# Altium project Bien_Quang_Cao_ver2.PrjPcb
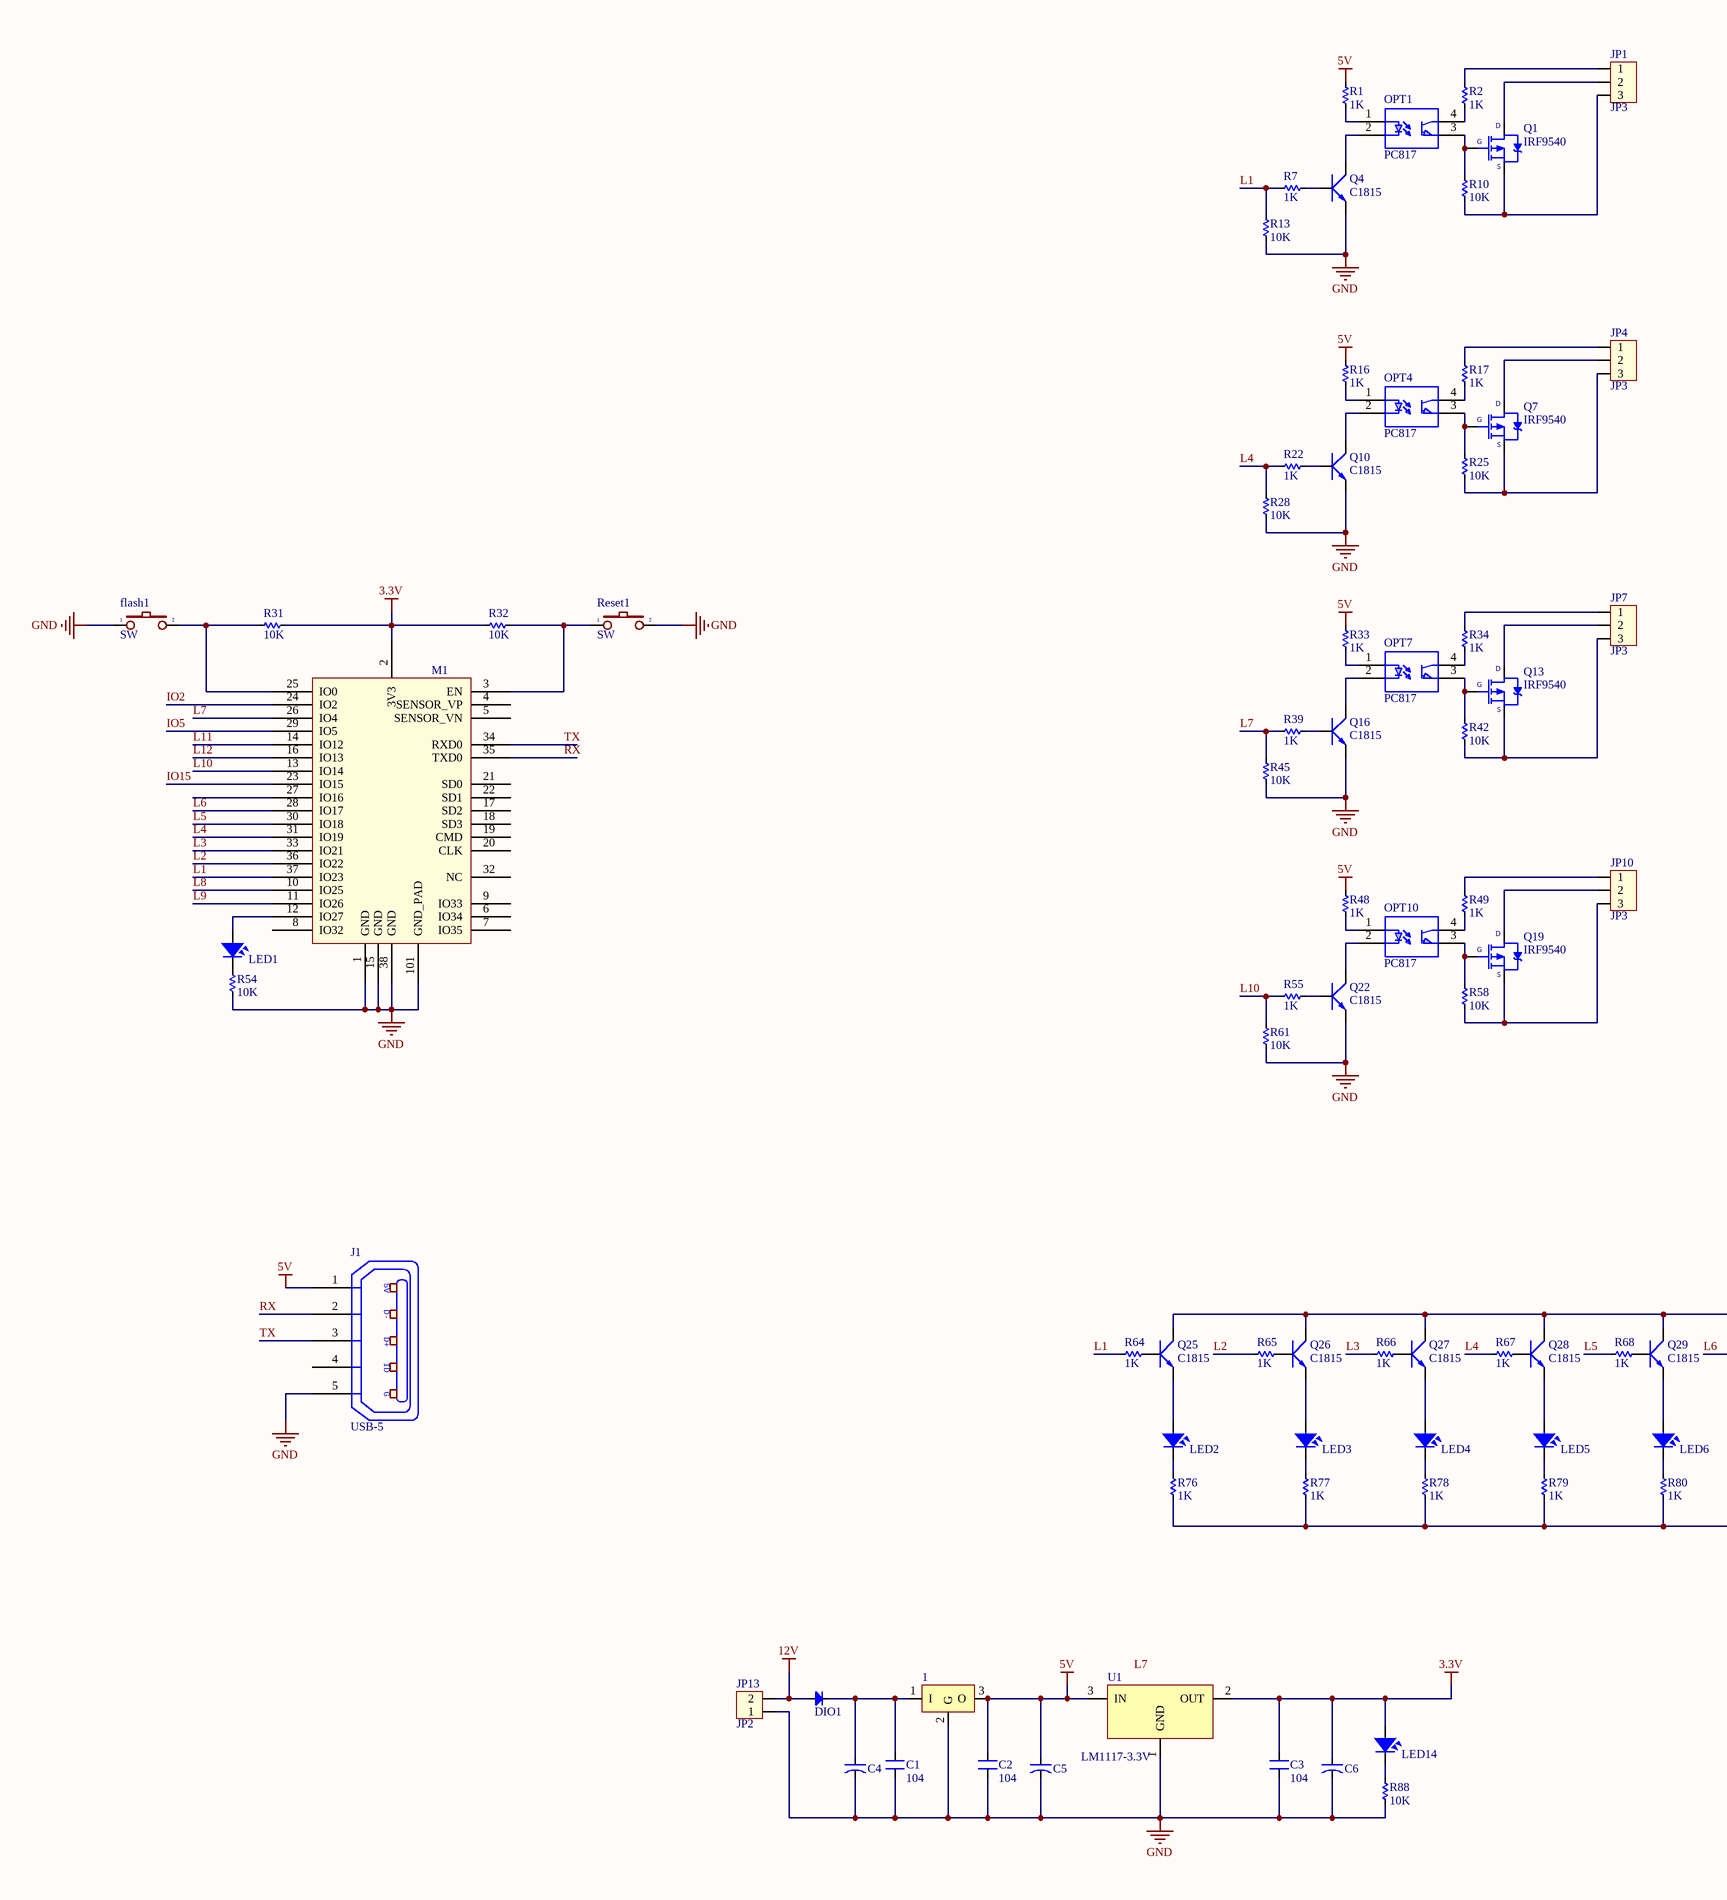
[diagram p0: Bien_Quang_Cao_ver2_schematic.SchDoc, left]
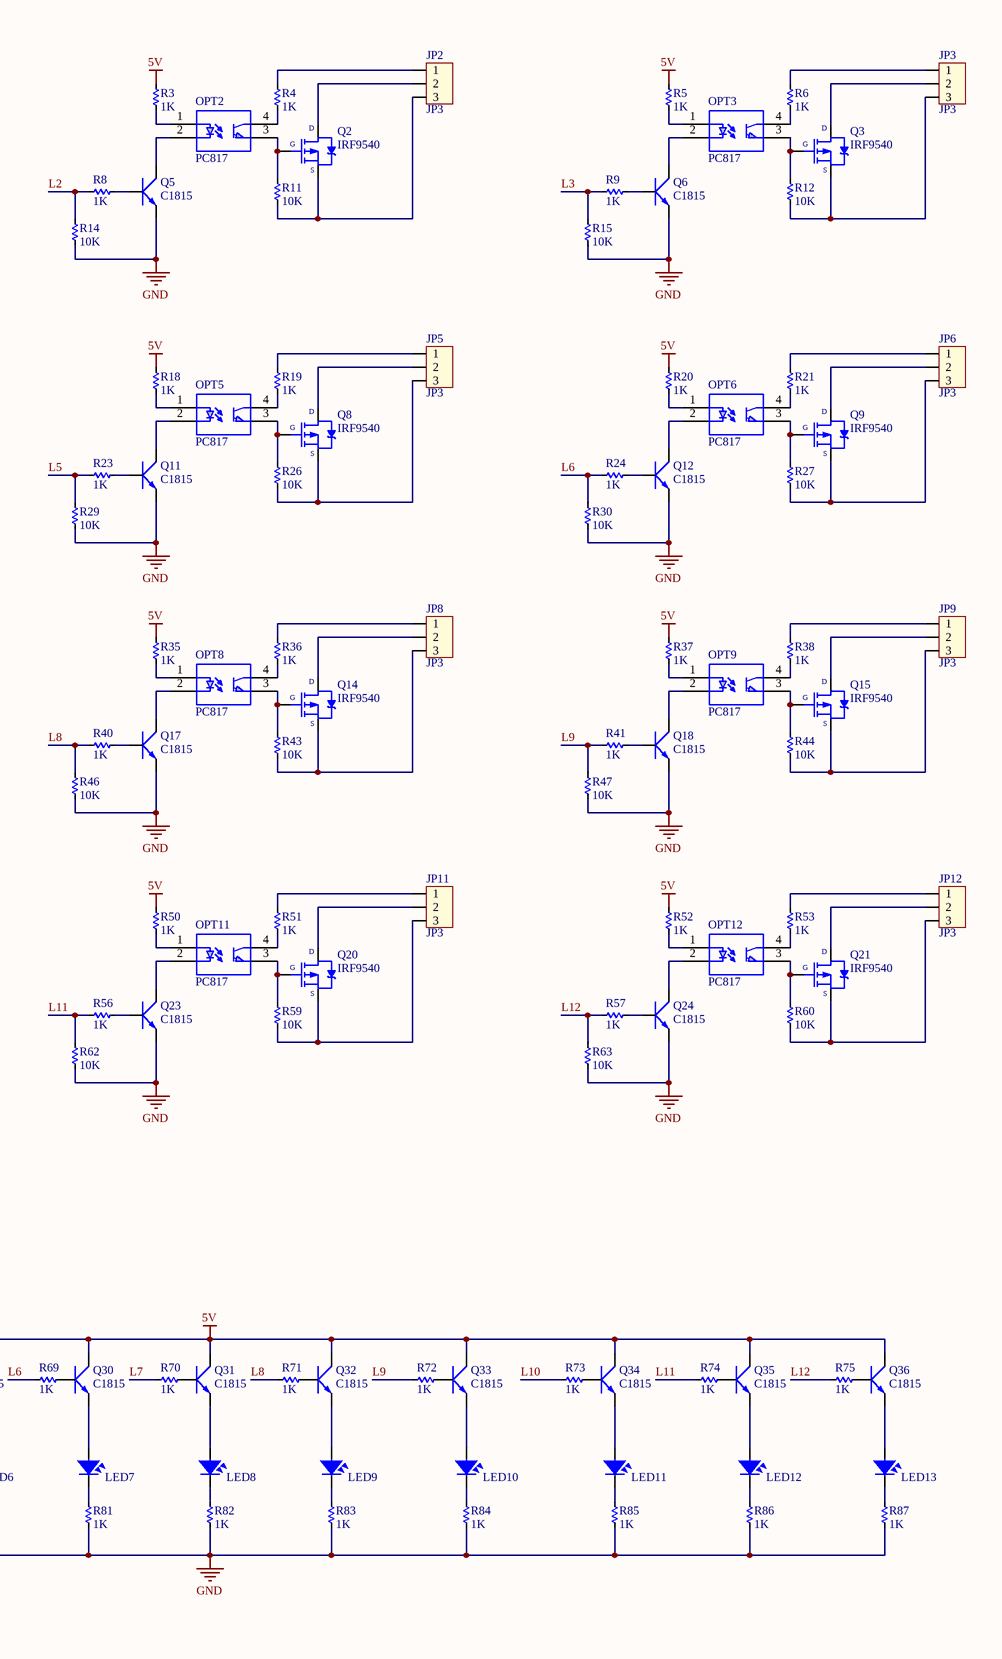
[diagram p1: Bien_Quang_Cao_ver2_schematic.SchDoc, right]
1 sheet, 176 parts. Net scope: global (net labels, ports and power ports of the same name join across sheets).
Board file: Bien_Quang_Cao_ver2_pcb.PcbDoc

## Sheet Bien_Quang_Cao_ver2_schematic.SchDoc
size A2

### Parts
1  LM78xx  [TO252-123]  (value not drawn)
C1  104  [SM-CAP-0805]
C2  104  [SM-CAP-0805]
C3  104  [SM-CAP-0805]
C4  CN-ALU-SMD  [CAP-ALU-SMD-5x5.5x1.4]  (value not drawn)
C5  CN-ALU-SMD  [CAP-ALU-SMD-5x5.5x1.4]  (value not drawn)
C6  CN-ALU-SMD  [CAP-ALU-SMD-5x5.5x1.4]  (value not drawn)
DIO1  Diode SMD  [DIO-SMD-106]  (value not drawn)
flash1  SW  [SW-DIP1]
J1  USB-5  [USB-M1]
JP1  JP3  [CON 3/9.5mm - CHAN LECH]
JP2  JP3  [CON 3/9.5mm - CHAN LECH]
JP3  JP3  [CON 3/9.5mm - CHAN LECH]
JP4  JP3  [CON 3/9.5mm - CHAN LECH]
JP5  JP3  [CON 3/9.5mm - CHAN LECH]
JP6  JP3  [CON 3/9.5mm - CHAN LECH]
JP7  JP3  [CON 3/9.5mm - CHAN LECH]
JP8  JP3  [CON 3/9.5mm - CHAN LECH]
JP9  JP3  [CON 3/9.5mm - CHAN LECH]
JP10  JP3  [CON 3/9.5mm - CHAN LECH]
JP11  JP3  [CON 3/9.5mm - CHAN LECH]
JP12  JP3  [CON 3/9.5mm - CHAN LECH]
JP13  JP2  [CON 2/7.62mm]
LED1  LED  [LED-0805-Blue]  (value not drawn)
LED2  LED  [LED-0805-Blue]  (value not drawn)
LED3  LED  [LED-0805-Blue]  (value not drawn)
LED4  LED  [LED-0805-Blue]  (value not drawn)
LED5  LED  [LED-0805-Blue]  (value not drawn)
LED6  LED  [LED-0805-Blue]  (value not drawn)
LED7  LED  [LED-0805-Blue]  (value not drawn)
LED8  LED  [LED-0805-Blue]  (value not drawn)
LED9  LED  [LED-0805-Blue]  (value not drawn)
LED10  LED  [LED-0805-Blue]  (value not drawn)
LED11  LED  [LED-0805-Blue]  (value not drawn)
LED12  LED  [LED-0805-Blue]  (value not drawn)
LED13  LED  [LED-0805-Blue]  (value not drawn)
LED14  LED  [LED-0805-Blue]  (value not drawn)
M1  ESP32S_Module  [ESP32S]  (value not drawn)
OPT1  PC817  [DIP-4 SMD]
OPT2  PC817  [DIP-4 SMD]
OPT3  PC817  [DIP-4 SMD]
OPT4  PC817  [DIP-4 SMD]
OPT5  PC817  [DIP-4 SMD]
OPT6  PC817  [DIP-4 SMD]
OPT7  PC817  [DIP-4 SMD]
OPT8  PC817  [DIP-4 SMD]
OPT9  PC817  [DIP-4 SMD]
OPT10  PC817  [DIP-4 SMD]
OPT11  PC817  [DIP-4 SMD]
OPT12  PC817  [DIP-4 SMD]
Q1  IRF9540  [TO247]
Q2  IRF9540  [TO247]
Q3  IRF9540  [TO247]
Q4  C1815  [SOT23B]
Q5  C1815  [SOT23B]
Q6  C1815  [SOT23B]
Q7  IRF9540  [TO247]
Q8  IRF9540  [TO247]
Q9  IRF9540  [TO247]
Q10  C1815  [SOT23B]
Q11  C1815  [SOT23B]
Q12  C1815  [SOT23B]
Q13  IRF9540  [TO247]
Q14  IRF9540  [TO247]
Q15  IRF9540  [TO247]
Q16  C1815  [SOT23B]
Q17  C1815  [SOT23B]
Q18  C1815  [SOT23B]
Q19  IRF9540  [TO247]
Q20  IRF9540  [TO247]
Q21  IRF9540  [TO247]
Q22  C1815  [SOT23B]
Q23  C1815  [SOT23B]
Q24  C1815  [SOT23B]
Q25  C1815  [SOT23B]
Q26  C1815  [SOT23B]
Q27  C1815  [SOT23B]
Q28  C1815  [SOT23B]
Q29  C1815  [SOT23B]
Q30  C1815  [SOT23B]
Q31  C1815  [SOT23B]
Q32  C1815  [SOT23B]
Q33  C1815  [SOT23B]
Q34  C1815  [SOT23B]
Q35  C1815  [SOT23B]
Q36  C1815  [SOT23B]
R1  1K  [RES-SMD-0805]
R2  1K  [RES-SMD-0805]
R3  1K  [RES-SMD-0805]
R4  1K  [RES-SMD-0805]
R5  1K  [RES-SMD-0805]
R6  1K  [RES-SMD-0805]
R7  1K  [RES-SMD-0805]
R8  1K  [RES-SMD-0805]
R9  1K  [RES-SMD-0805]
R10  10K  [RES-SMD-0805]
R11  10K  [RES-SMD-0805]
R12  10K  [RES-SMD-0805]
R13  10K  [RES-SMD-0805]
R14  10K  [RES-SMD-0805]
R15  10K  [RES-SMD-0805]
R16  1K  [RES-SMD-0805]
R17  1K  [RES-SMD-0805]
R18  1K  [RES-SMD-0805]
R19  1K  [RES-SMD-0805]
R20  1K  [RES-SMD-0805]
R21  1K  [RES-SMD-0805]
R22  1K  [RES-SMD-0805]
R23  1K  [RES-SMD-0805]
R24  1K  [RES-SMD-0805]
R25  10K  [RES-SMD-0805]
R26  10K  [RES-SMD-0805]
R27  10K  [RES-SMD-0805]
R28  10K  [RES-SMD-0805]
R29  10K  [RES-SMD-0805]
R30  10K  [RES-SMD-0805]
R31  10K  [RES-SMD-0805]
R32  10K  [RES-SMD-0805]
R33  1K  [RES-SMD-0805]
R34  1K  [RES-SMD-0805]
R35  1K  [RES-SMD-0805]
R36  1K  [RES-SMD-0805]
R37  1K  [RES-SMD-0805]
R38  1K  [RES-SMD-0805]
R39  1K  [RES-SMD-0805]
R40  1K  [RES-SMD-0805]
R41  1K  [RES-SMD-0805]
R42  10K  [RES-SMD-0805]
R43  10K  [RES-SMD-0805]
R44  10K  [RES-SMD-0805]
R45  10K  [RES-SMD-0805]
R46  10K  [RES-SMD-0805]
R47  10K  [RES-SMD-0805]
R48  1K  [RES-SMD-0805]
R49  1K  [RES-SMD-0805]
R50  1K  [RES-SMD-0805]
R51  1K  [RES-SMD-0805]
R52  1K  [RES-SMD-0805]
R53  1K  [RES-SMD-0805]
R54  10K  [RES-SMD-0805]
R55  1K  [RES-SMD-0805]
R56  1K  [RES-SMD-0805]
R57  1K  [RES-SMD-0805]
R58  10K  [RES-SMD-0805]
R59  10K  [RES-SMD-0805]
R60  10K  [RES-SMD-0805]
R61  10K  [RES-SMD-0805]
R62  10K  [RES-SMD-0805]
R63  10K  [RES-SMD-0805]
R64  1K  [RES-SMD-0805]
R65  1K  [RES-SMD-0805]
R66  1K  [RES-SMD-0805]
R67  1K  [RES-SMD-0805]
R68  1K  [RES-SMD-0805]
R69  1K  [RES-SMD-0805]
R70  1K  [RES-SMD-0805]
R71  1K  [RES-SMD-0805]
R72  1K  [RES-SMD-0805]
R73  1K  [RES-SMD-0805]
R74  1K  [RES-SMD-0805]
R75  1K  [RES-SMD-0805]
R76  1K  [RES-SMD-0805]
R77  1K  [RES-SMD-0805]
R78  1K  [RES-SMD-0805]
R79  1K  [RES-SMD-0805]
R80  1K  [RES-SMD-0805]
R81  1K  [RES-SMD-0805]
R82  1K  [RES-SMD-0805]
R83  1K  [RES-SMD-0805]
R84  1K  [RES-SMD-0805]
R85  1K  [RES-SMD-0805]
R86  1K  [RES-SMD-0805]
R87  1K  [RES-SMD-0805]
R88  10K  [RES-SMD-0805]
Reset1  SW  [SW1-SMD]
U1  LM1117-3.3V  [SOT223]

### Nets
3.3V: C3.2 C6.1 LED14.1 M1.2(3V3) R31.2 R32.1 U1.2(OUT)
5V: 1.3(O) C2.2 C5.1 J1.1(P1) Q25.2(C) Q26.2(C) Q27.2(C) Q28.2(C) Q29.2(C) Q30.2(C) Q31.2(C) Q32.2(C) Q33.2(C) Q34.2(C) Q35.2(C) Q36.2(C) R1.2 R3.2 R5.2 R16.2 R18.2 R20.2 R33.2 R35.2 R37.2 R48.2 R50.2 R52.2 U1.3(IN)
12V: DIO1.1(A) JP13.2
GND: 1.2(G) C1.1 C2.1 C3.1 C4.2 C5.2 C6.2 flash1.1 J1.5(P5) JP13.1 M1.1(GND) M1.15(GND) M1.38(GND) M1.101(GND_PAD) Q4.1(E) Q5.1(E) Q6.1(E) Q10.1(E) Q11.1(E) Q12.1(E) Q16.1(E) Q17.1(E) Q18.1(E) Q22.1(E) Q23.1(E) Q24.1(E) R13.1 R14.1 R15.1 R28.1 R29.1 R30.1 R45.1 R46.1 R47.1 R54.1 R61.1 R62.1 R63.1 R76.2 R77.2 R78.2 R79.2 R80.2 R81.2 R82.2 R83.2 R84.2 R85.2 R86.2 R87.2 R88.1 Reset1.2 U1.1(GND)
IO2: M1.24(IO2)
IO5: M1.29(IO5)
IO15: M1.23(IO15)
L1: M1.37(IO23) R7.1 R13.2 R64.1
L2: M1.36(IO22) R8.1 R14.2 R65.1
L3: M1.33(IO21) R9.1 R15.2 R66.1
L4: M1.31(IO19) R22.1 R28.2 R67.1
L5: M1.30(IO18) R23.1 R29.2 R68.1
L6: M1.28(IO17) R24.1 R30.2 R69.1
L7: M1.26(IO4) R39.1 R45.2 R70.1
L8: M1.10(IO25) R40.1 R46.2 R71.1
L9: M1.11(IO26) R41.1 R47.2 R72.1
L10: M1.13(IO14) R55.1 R61.2 R73.1
L11: M1.14(IO12) R56.1 R62.2 R74.1
L12: M1.16(IO13) R57.1 R63.2 R75.1
RX: J1.2(P2) M1.35(TXD0)
TX: J1.3(P3) M1.34(RXD0)
Net1_1: 1.1(I) C1.2 C4.1 DIO1.2(K)
Netflash1_2: flash1.2 M1.25(IO0) R31.1
NetJP1_1: JP1.1 R2.1
NetJP1_2: JP1.2 Q1.2(D)
NetJP1_3: JP1.3 Q1.3(S) R10.2
NetJP2_1: JP2.1 R4.1
NetJP2_2: JP2.2 Q2.2(D)
NetJP2_3: JP2.3 Q2.3(S) R11.2
NetJP3_1: JP3.1 R6.1
NetJP3_2: JP3.2 Q3.2(D)
NetJP3_3: JP3.3 Q3.3(S) R12.2
NetJP4_1: JP4.1 R17.1
NetJP4_2: JP4.2 Q7.2(D)
NetJP4_3: JP4.3 Q7.3(S) R25.2
NetJP5_1: JP5.1 R19.1
NetJP5_2: JP5.2 Q8.2(D)
NetJP5_3: JP5.3 Q8.3(S) R26.2
NetJP6_1: JP6.1 R21.1
NetJP6_2: JP6.2 Q9.2(D)
NetJP6_3: JP6.3 Q9.3(S) R27.2
NetJP7_1: JP7.1 R34.1
NetJP7_2: JP7.2 Q13.2(D)
NetJP7_3: JP7.3 Q13.3(S) R42.2
NetJP8_1: JP8.1 R36.1
NetJP8_2: JP8.2 Q14.2(D)
NetJP8_3: JP8.3 Q14.3(S) R43.2
NetJP9_1: JP9.1 R38.1
NetJP9_2: JP9.2 Q15.2(D)
NetJP9_3: JP9.3 Q15.3(S) R44.2
NetJP10_1: JP10.1 R49.1
NetJP10_2: JP10.2 Q19.2(D)
NetJP10_3: JP10.3 Q19.3(S) R58.2
NetJP11_1: JP11.1 R51.1
NetJP11_2: JP11.2 Q20.2(D)
NetJP11_3: JP11.3 Q20.3(S) R59.2
NetJP12_1: JP12.1 R53.1
NetJP12_2: JP12.2 Q21.2(D)
NetJP12_3: JP12.3 Q21.3(S) R60.2
NetLED1_1: LED1.1 M1.12(IO27)
NetLED1_2: LED1.2 R54.2
NetLED2_1: LED2.1 Q25.1(E)
NetLED2_2: LED2.2 R76.1
NetLED3_1: LED3.1 Q26.1(E)
NetLED3_2: LED3.2 R77.1
NetLED4_1: LED4.1 Q27.1(E)
NetLED4_2: LED4.2 R78.1
NetLED5_1: LED5.1 Q28.1(E)
NetLED5_2: LED5.2 R79.1
NetLED6_1: LED6.1 Q29.1(E)
NetLED6_2: LED6.2 R80.1
NetLED7_1: LED7.1 Q30.1(E)
NetLED7_2: LED7.2 R81.1
NetLED8_1: LED8.1 Q31.1(E)
NetLED8_2: LED8.2 R82.1
NetLED9_1: LED9.1 Q32.1(E)
NetLED9_2: LED9.2 R83.1
NetLED10_1: LED10.1 Q33.1(E)
NetLED10_2: LED10.2 R84.1
NetLED11_1: LED11.1 Q34.1(E)
NetLED11_2: LED11.2 R85.1
NetLED12_1: LED12.1 Q35.1(E)
NetLED12_2: LED12.2 R86.1
NetLED13_1: LED13.1 Q36.1(E)
NetLED13_2: LED13.2 R87.1
NetLED14_2: LED14.2 R88.2
NetM1_3: M1.3(EN) R32.2 Reset1.1
NetOPT1_1: OPT1.1(A) R1.1
NetOPT1_2: OPT1.2(K) Q4.2(C)
NetOPT1_3: OPT1.3(EMISSOR) Q1.1(G) R10.1
NetOPT1_4: OPT1.4(COLETOR) R2.2
NetOPT2_1: OPT2.1(A) R3.1
NetOPT2_2: OPT2.2(K) Q5.2(C)
NetOPT2_3: OPT2.3(EMISSOR) Q2.1(G) R11.1
NetOPT2_4: OPT2.4(COLETOR) R4.2
NetOPT3_1: OPT3.1(A) R5.1
NetOPT3_2: OPT3.2(K) Q6.2(C)
NetOPT3_3: OPT3.3(EMISSOR) Q3.1(G) R12.1
NetOPT3_4: OPT3.4(COLETOR) R6.2
NetOPT4_1: OPT4.1(A) R16.1
NetOPT4_2: OPT4.2(K) Q10.2(C)
NetOPT4_3: OPT4.3(EMISSOR) Q7.1(G) R25.1
NetOPT4_4: OPT4.4(COLETOR) R17.2
NetOPT5_1: OPT5.1(A) R18.1
NetOPT5_2: OPT5.2(K) Q11.2(C)
NetOPT5_3: OPT5.3(EMISSOR) Q8.1(G) R26.1
NetOPT5_4: OPT5.4(COLETOR) R19.2
NetOPT6_1: OPT6.1(A) R20.1
NetOPT6_2: OPT6.2(K) Q12.2(C)
NetOPT6_3: OPT6.3(EMISSOR) Q9.1(G) R27.1
NetOPT6_4: OPT6.4(COLETOR) R21.2
NetOPT7_1: OPT7.1(A) R33.1
NetOPT7_2: OPT7.2(K) Q16.2(C)
NetOPT7_3: OPT7.3(EMISSOR) Q13.1(G) R42.1
NetOPT7_4: OPT7.4(COLETOR) R34.2
NetOPT8_1: OPT8.1(A) R35.1
NetOPT8_2: OPT8.2(K) Q17.2(C)
NetOPT8_3: OPT8.3(EMISSOR) Q14.1(G) R43.1
NetOPT8_4: OPT8.4(COLETOR) R36.2
NetOPT9_1: OPT9.1(A) R37.1
NetOPT9_2: OPT9.2(K) Q18.2(C)
NetOPT9_3: OPT9.3(EMISSOR) Q15.1(G) R44.1
NetOPT9_4: OPT9.4(COLETOR) R38.2
NetOPT10_1: OPT10.1(A) R48.1
NetOPT10_2: OPT10.2(K) Q22.2(C)
NetOPT10_3: OPT10.3(EMISSOR) Q19.1(G) R58.1
NetOPT10_4: OPT10.4(COLETOR) R49.2
NetOPT11_1: OPT11.1(A) R50.1
NetOPT11_2: OPT11.2(K) Q23.2(C)
NetOPT11_3: OPT11.3(EMISSOR) Q20.1(G) R59.1
NetOPT11_4: OPT11.4(COLETOR) R51.2
NetOPT12_1: OPT12.1(A) R52.1
NetOPT12_2: OPT12.2(K) Q24.2(C)
NetOPT12_3: OPT12.3(EMISSOR) Q21.1(G) R60.1
NetOPT12_4: OPT12.4(COLETOR) R53.2
NetQ4_3: Q4.3(B) R7.2
NetQ5_3: Q5.3(B) R8.2
NetQ6_3: Q6.3(B) R9.2
NetQ10_3: Q10.3(B) R22.2
NetQ11_3: Q11.3(B) R23.2
NetQ12_3: Q12.3(B) R24.2
NetQ16_3: Q16.3(B) R39.2
NetQ17_3: Q17.3(B) R40.2
NetQ18_3: Q18.3(B) R41.2
NetQ22_3: Q22.3(B) R55.2
NetQ23_3: Q23.3(B) R56.2
NetQ24_3: Q24.3(B) R57.2
NetQ25_3: Q25.3(B) R64.2
NetQ26_3: Q26.3(B) R65.2
NetQ27_3: Q27.3(B) R66.2
NetQ28_3: Q28.3(B) R67.2
NetQ29_3: Q29.3(B) R68.2
NetQ30_3: Q30.3(B) R69.2
NetQ31_3: Q31.3(B) R70.2
NetQ32_3: Q32.3(B) R71.2
NetQ33_3: Q33.3(B) R72.2
NetQ34_3: Q34.3(B) R73.2
NetQ35_3: Q35.3(B) R74.2
NetQ36_3: Q36.3(B) R75.2

Not connected (* = marked no-connect by the designer): J1 4(P4); M1 4(SENSOR_VP) 5(SENSOR_VN) 6(IO34) 7(IO35) 8(IO32) 9(IO33) 17(SD2) 18(SD3) 19(CMD) 20(CLK) 21(SD0) 22(SD1) 27(IO16) 32(NC)

### Notes on the sheet
- Labels drawn without touching a wire or pin: L7
- (in symbol USB-5) 5V; D-; D+; ID; G

### Library data of the parts
1 = LM78xx: Positive Voltage Regulator; Note: Tab is connected to pin 3 (GND).; Published: 24-Aug-2001; LatestRevisionDate: 17-Jul-2002; LatestRevisionNote: Re-released for DXP Platform.; DatasheetVersion: Apr-1994; PackageVersion: Jul-1998; PackageReference: ISOWATT220AB; Publisher: Altium Limited; PackageDescription: TO, Thru-Hole, Vertical, Heatsink Mounted; 3 In-Line Leads; Pitch 2.54 mm; Pin sequence 1, 3, 2; ComponentLink1Description: Manufacturer Link; ComponentLink1URL: http://www.st.com/; ComponentLink2Description: Datasheet; ComponentLink2URL: http://www.st.com/stonline/products/literature/ds/2146/l78m05c.pdf
C1-C3 = CN: Value: 0,1uF/300V; Designed by: VanDungEvn
C4-C6 = CN-ALU-SMD: Polarized Capacitor (Axial); Published: 8-Jun-2000; LatestRevisionDate: 17-Jul-2002; LatestRevisionNote: Re-released for DXP Platform.; PackageReference: POLAR0.8; Publisher: Altium Limited
DIO1 = Diode SMD: Default Diode; Code - JEDEC: DO-214-AB; Value: 1N5007; Published: 8-Jun-2000; Revision: July-2002: Re-released for DXP Platform.; Publisher: Altium Limited
flash1 Reset1 = SW2: Switch button 2 pin; Value: SW chip 2 pin
J1 = USB-5: Manufacturer: FCI; Manufacturer Part Number: 10118193-0001LF; Connector Type: USB - micro B; Number of Contacts: 5; Gender: Receptacle; Specifications: USB 2.0; .Creator: MM; .Checked PCB: RF; Supplier 1: Digi-Key; RoHS: RoHS Compliant; Category: Connectors, Interconnects; Stock 1: 28642; Pricing 1: 1=0.46, 10=0.433, 25=0.3712, 50=0.3156, 100=0.3032, 250=0.27224, 500=0.25988 (USD); Packaging: Cut Tape (CT); Mounting Type: Surface Mount, Right Angle, Horizontal; Features: Shielded, Solder Retention; Ingress Protection: -; ComponentLink1URL: http://portal.fciconnect.com/Comergent//fci/drawing/10118193.pdf; ComponentLink1Description: http://portal.fciconnect.com/Comergent//fci/drawing/10118193.pdf; Supplier Part Number 1: 609-4616-1-ND; .Checked SCH: MM
JP1-JP12 = Con3: Connector 3; Value: Connector 3
JP13 = Con2: Connector 2; Value: Connector 2
LED1-LED14 = LED SMD: Value: LED 3 - 5 ly 2 Colour
M1 = ESP32S_Module: Esp-32S; Datasheet: https://espressif.com/sites/default/files/documentation/esp_wroom_32_datasheet_en.pdf
OPT1-OPT12 = PC817: OptoAcoplador 4 terminais; Encapsulamento: SMD; Descrição: OptoAcoplador 4 Terminais; Valor: *; Marca: *; Observação: *
Q1-Q3 Q7-Q9 Q13-Q15 Q19-Q21 = IRF9540: HEXFET P-Channel Power MOSFET; Note: Pin 2 is electrically connected to pin 4.; Published: 8-Jun-2000; LatestRevisionDate: 17-Jul-2002; LatestRevisionNote: Re-released for DXP Platform.; DatasheetVersion: PD-9.421C; PackageVersion: Feb-1997; PackageReference: TO-220AB; Publisher: Altium Limited; PackageDescription: TO, Thru-Hole, Vertical, Heatsink Mounted; 3 In-Line Leads; Pitch 2.54 mm; ComponentLink1Description: Manufacturer Link; ComponentLink1URL: http://www.irf.com/; ComponentLink2Description: Datasheet; ComponentLink2URL: http://www.irf.com/product-info/datasheets/data/irf9540.pdf
Q4-Q6 Q10-Q12 Q16-Q18 Q22-Q36 = C1815: NPN 600mW, ECB; Value: C1815
R1-R88 = Res-SMD: Resistor; Manufacturer: Generic Components; Class: Passive; Published: 08/06/2000; Publisher: Altium Hobart Technology Centre
U1 = LM1117: 800mA Low-Dropout Linear Regulator; Creator: Nguyen Ba Bien; Website: http://group3i.net